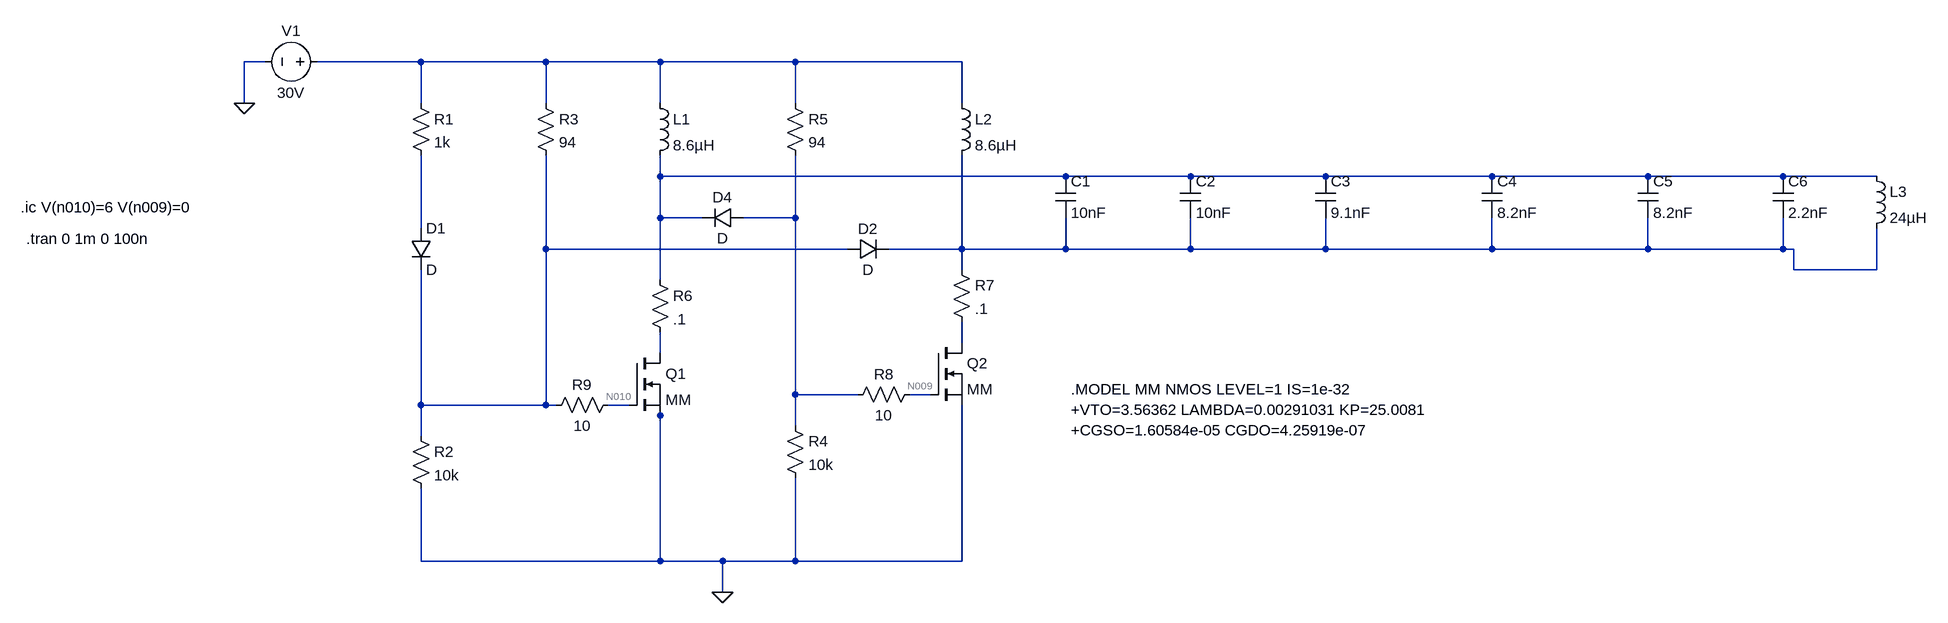
[diagram p0: schematic Final TC.asc]
Final TC.asc, the LTspice schematic file:
Version 4
SHEET 1 2036 756
WIRE -528 -80 -560 -80
WIRE -288 -80 -448 -80
WIRE -96 -80 -288 -80
WIRE 80 -80 -96 -80
WIRE 288 -80 80 -80
WIRE 544 -80 288 -80
WIRE -560 -16 -560 -80
WIRE -288 -16 -288 -80
WIRE -96 -16 -96 -80
WIRE 80 -16 80 -80
WIRE 288 -16 288 -80
WIRE 544 -16 544 -80
WIRE 80 96 80 64
WIRE 704 96 80 96
WIRE 896 96 704 96
WIRE 1104 96 896 96
WIRE 1360 96 1104 96
WIRE 1600 96 1360 96
WIRE 1808 96 1600 96
WIRE 1952 96 1808 96
WIRE 80 160 80 96
WIRE 144 160 80 160
WIRE 288 160 288 64
WIRE 288 160 208 160
WIRE -288 176 -288 64
WIRE -96 208 -96 64
WIRE 368 208 -96 208
WIRE 544 208 544 64
WIRE 544 208 432 208
WIRE 704 208 704 160
WIRE 704 208 544 208
WIRE 896 208 896 160
WIRE 896 208 704 208
WIRE 1104 208 1104 160
WIRE 1104 208 896 208
WIRE 1360 208 1360 160
WIRE 1360 208 1104 208
WIRE 1600 208 1600 160
WIRE 1600 208 1360 208
WIRE 1808 208 1808 160
WIRE 1808 208 1600 208
WIRE 1824 208 1808 208
WIRE 544 240 544 208
WIRE 1824 240 1824 208
WIRE 1952 240 1952 176
WIRE 1952 240 1824 240
WIRE 80 256 80 160
WIRE 544 352 544 320
WIRE 80 368 80 336
WIRE 288 432 288 160
WIRE 384 432 288 432
WIRE 496 432 464 432
WIRE -288 448 -288 240
WIRE -96 448 -96 208
WIRE -96 448 -288 448
WIRE -80 448 -96 448
WIRE 32 448 0 448
WIRE 80 464 80 448
WIRE 288 480 288 432
WIRE -288 496 -288 448
WIRE -288 688 -288 576
WIRE 80 688 80 464
WIRE 80 688 -288 688
WIRE 176 688 80 688
WIRE 288 688 288 560
WIRE 288 688 176 688
WIRE 544 688 544 448
WIRE 544 688 288 688
WIRE 176 736 176 688
FLAG 176 736 0
FLAG -560 -16 0
DATAFLAG -256 -80 ""
SYMBOL res -304 -32 R0
SYMATTR InstName R1
SYMATTR Value 1k
SYMBOL res -112 -32 R0
SYMATTR InstName R3
SYMATTR Value 94
SYMBOL res 272 -32 R0
SYMATTR InstName R5
SYMATTR Value 94
SYMBOL res -304 480 R0
SYMATTR InstName R2
SYMATTR Value 10k
SYMBOL res 272 464 R0
SYMATTR InstName R4
SYMATTR Value 10k
SYMBOL ind 64 -32 R0
SYMATTR InstName L1
SYMATTR Value 8.6µH
SYMATTR SpiceLine Rser=.1
SYMBOL ind 528 -32 R0
SYMATTR InstName L2
SYMATTR Value 8.6µH
SYMATTR SpiceLine Rser=.1
SYMBOL nmos 496 352 R0
SYMATTR InstName Q2
SYMATTR Value MM
SYMBOL nmos 32 368 R0
SYMATTR InstName Q1
SYMATTR Value MM
SYMBOL diode -304 176 R0
SYMATTR InstName D1
SYMBOL cap 688 96 R0
SYMATTR InstName C1
SYMATTR Value 10nF
SYMBOL cap 880 96 R0
SYMATTR InstName C2
SYMATTR Value 10nF
SYMBOL cap 1088 96 R0
SYMATTR InstName C3
SYMATTR Value 9.1nF
SYMBOL cap 1344 96 R0
SYMATTR InstName C4
SYMATTR Value 8.2nF
SYMBOL cap 1584 96 R0
SYMATTR InstName C5
SYMATTR Value 8.2nF
SYMBOL cap 1792 96 R0
SYMATTR InstName C6
SYMATTR Value 2.2nF
SYMBOL ind 1936 80 R0
SYMATTR InstName L3
SYMATTR Value 24µH
SYMATTR SpiceLine Rser=.1
SYMBOL voltage -432 -80 R90
WINDOW 0 -32 56 VBottom 2
WINDOW 3 32 56 VTop 2
SYMATTR InstName V1
SYMATTR Value 30V
SYMBOL res 64 240 R0
SYMATTR InstName R6
SYMATTR Value .1
SYMBOL res 528 224 R0
SYMATTR InstName R7
SYMATTR Value .1
SYMBOL res 480 416 R90
WINDOW 0 0 56 VBottom 2
WINDOW 3 32 56 VTop 2
SYMATTR InstName R8
SYMATTR Value 10
SYMBOL res 16 432 R90
WINDOW 0 0 56 VBottom 2
WINDOW 3 32 56 VTop 2
SYMATTR InstName R9
SYMATTR Value 10
SYMBOL diode 208 144 R90
WINDOW 0 0 32 VBottom 2
WINDOW 3 32 32 VTop 2
SYMATTR InstName D4
SYMBOL diode 368 224 R270
WINDOW 0 32 32 VTop 2
WINDOW 3 0 32 VBottom 2
SYMATTR InstName D2
TEXT 712 424 Left 2 !.MODEL MM NMOS LEVEL=1 IS=1e-32\n+VTO=3.56362 LAMBDA=0.00291031 KP=25.0081\n+CGSO=1.60584e-05 CGDO=4.25919e-07
TEXT -904 144 Left 2 !.ic V(n010)=6 V(n009)=0
TEXT -896 192 Left 2 !.tran 0 1m 0 100n

The netlist it stands for:
* Final TC.asc
R1 N001 N004 1k
R3 N001 N005 94
R5 N001 N003 94
R2 N005 0 10k
R4 N003 0 10k
L1 N001 N002 8.6µH Rser=.1
L2 N001 N006 8.6µH Rser=.1
M§Q2 N007 N009 0 0 MM
M§Q1 N008 N010 0 0 MM
D1 N004 N005 D
C1 N002 N006 10nF
C2 N002 N006 10nF
C3 N002 N006 9.1nF
C4 N002 N006 8.2nF
C5 N002 N006 8.2nF
C6 N002 N006 2.2nF
L3 N002 N006 24µH Rser=.1
V1 N001 0 30V
R6 N002 N008 .1
R7 N006 N007 .1
R8 N009 N003 10
R9 N010 N005 10
D4 N003 N002 D
D2 N005 N006 D
.model D D
.lib standard.dio
.model NMOS NMOS
.model PMOS PMOS
.lib standard.mos
.MODEL MM NMOS LEVEL=1 IS=1e-32
+VTO=3.56362 LAMBDA=0.00291031 KP=25.0081
+CGSO=1.60584e-05 CGDO=4.25919e-07
.ic V(n010)=6 V(n009)=0
.tran 0 1m 0 100n
.backanno
.end